# Altium project Terminator_CAN.PrjPcb
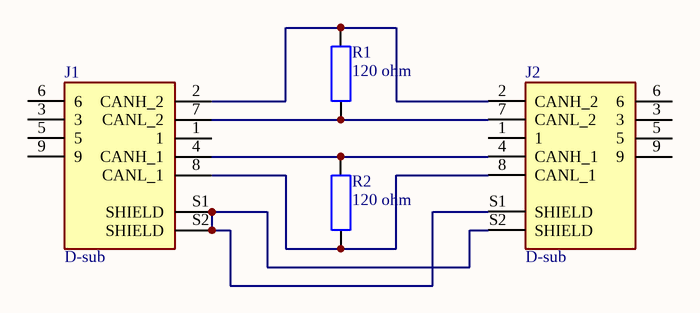
[diagram p0: T_CAN.SchDoc]
1 sheet, 4 parts. Net scope: global (net labels, ports and power ports of the same name join across sheets).
Board file: T_CAN.PcbDoc

## Sheet T_CAN.SchDoc
size A4; SheetNumber: 1; SheetTotal: 1

### Parts
J1  D-sub  [ASSMANN_A-DF_09_A_KG-T2S]
J2  D-sub  [ASSMANN_A-DF_09_A_KG-T2S]
R1  120 ohm  [R0805]
R2  120 ohm  [R0805]

### Nets
NetJ1_2: J1.2(CANH_2) J2.2(CANH_2) R1.2
NetJ1_4: J1.4(CANH_1) J2.4(CANH_1) R2.2
NetJ1_7: J1.7(CANL_2) J2.7(CANL_2) R1.1
NetJ1_8: J1.8(CANL_1) J2.8(CANL_1) R2.1
NetJ1_S1: J1.S1(SHIELD) J1.S2(SHIELD) J2.S1(SHIELD) J2.S2(SHIELD)

Not connected (* = marked no-connect by the designer): J1 1 3 5 6 9; J2 1 3 5 6 9

### Library data of the parts
J1 J2 = A-DF_09_A_KG-T2S: 9 Position D-Sub Receptacle, Female Sockets Connector; MF: Assmann WSW; MP: A-DF 09 A/KG-T2S; SnapEDA_Link: https://www.snapeda.com/parts/A-DF%2009%20A/KG-T2S/Assmann+WSW+Components/view-part/?ref=snap; Package: None; Value: *; Check_prices: https://www.snapeda.com/parts/A-DF%2009%20A/KG-T2S/Assmann+WSW+Components/view-part/?ref=eda; ComponentLink1Description: Chipdip link; ComponentLink1URL: https://www.chipdip.ru/product0/8014038088?ysclid=m1h00nzwfi234995937; Supplier 1: https://www.chipdip.ru/product0/8014038088?ysclid=m1h00nzwfi234995937
R1 R2 = AC0805FR-7W120RL: Chip Resistor Automotive Grade Thick Film 0805 120Ohm 1% Paper T/R; Manufacturer: Yageo; Value: 120R; Supplier: Digikey; Supplier Part Number: 13-AC0805FR-7W120RLCT-ND; Manufacturer Part Number: AC0805FR-7W120RL; RoHS: Yes; Category: Chip SMD Resistors; Stock: 9211; Pricing: 1=0,1, 10=0,048, 50=0,0318, 100=0,0269, 500=0,01894, 1000=0,01649 (USD); Case/Package: 339Case; Packaging: 10Packaging; ComponentLink1Description: Chipdip link; ComponentLink1URL: https://www.chipdip.ru/product0/8017642180; Supplier 1: https://www.chipdip.ru/product0/8017642180